# Altium schematic sheet 04_Motors.SchDoc: OpenCamera Slider - Motors
size A4; SheetNumber: 4; SheetTotal: 4; Distributor: DigiKey
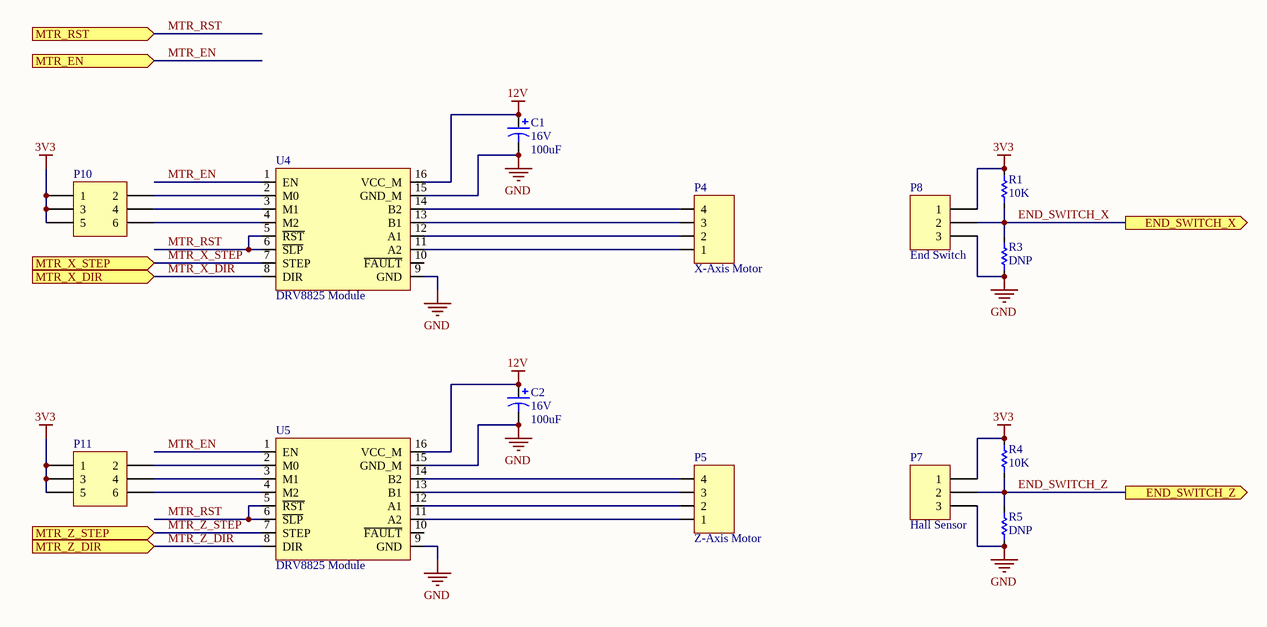
[diagram p0: 04_Motors.SchDoc]

## Parts
C1  16V  value 100uF  [Electrolytic Cap 3.2mm]
C2  16V  value 100uF  [Electrolytic Cap 3.2mm]
P4  X-Axis Motor  [TERMINAL_4POS_90DEG_2PART]
P5  Z-Axis Motor  [TERMINAL_4POS_90DEG_2PART]
P7  Hall Sensor  [TERMINAL_3POS_90DEG_2PART]
P8  End Switch  [TERMINAL_3POS_90DEG_2PART]
P10  Header 3X2  [HDR2X3]  (value not drawn)
P11  Header 3X2  [HDR2X3]  (value not drawn)
R1  value 10K  [0603]  (hidden comment: Res)
R3  value DNP  [0603]  (hidden comment: Res)  (no BOM)
R4  value 10K  [0603]  (hidden comment: Res)
R5  value DNP  [0603]  (hidden comment: Res)  (no BOM)
U4  DRV8825 Module  [DRV8825_Module]
U5  DRV8825 Module  [DRV8825_Module]

## Ports
END_SWITCH_X (out), END_SWITCH_Z (out), MTR_EN (in), MTR_RST (in), MTR_X_DIR (in), MTR_X_STEP (in), MTR_Z_DIR (in), MTR_Z_STEP (in)

## Nets
3V3: P7.1 P8.1 P10.1 P10.3 P10.5 P11.1 P11.3 P11.5 R1.2 R4.2
12V: C1.1 C2.1 U4.16(VCC_M) U5.16(VCC_M)
GND: C1.2 C2.2 P7.3 P8.3 R3.1 R5.1 U4.9(GND) U4.15(GND_M) U5.9(GND) U5.15(GND_M)
END_SWITCH_X: P8.2 R1.1 R3.2 ; port END_SWITCH_X
END_SWITCH_Z: P7.2 R4.1 R5.2 ; port END_SWITCH_Z
MTR_EN: U4.1(EN) U5.1(EN) ; port MTR_EN
MTR_RST: U4.5(~{RST}) U4.6(~{SLP}) U5.5(~{RST}) U5.6(~{SLP}) ; port MTR_RST
MTR_X_DIR: U4.8(DIR) ; port MTR_X_DIR
MTR_X_STEP: U4.7(STEP) ; port MTR_X_STEP
MTR_Z_DIR: U5.8(DIR) ; port MTR_Z_DIR
MTR_Z_STEP: U5.7(STEP) ; port MTR_Z_STEP
NetP4_1: P4.1 U4.11(A2)
NetP4_2: P4.2 U4.12(A1)
NetP4_3: P4.3 U4.13(B1)
NetP4_4: P4.4 U4.14(B2)
NetP5_1: P5.1 U5.11(A2)
NetP5_2: P5.2 U5.12(A1)
NetP5_3: P5.3 U5.13(B1)
NetP5_4: P5.4 U5.14(B2)
NetP10_2: P10.2 U4.2(M0)
NetP10_4: P10.4 U4.3(M1)
NetP10_6: P10.6 U4.4(M2)
NetP11_2: P11.2 U5.2(M0)
NetP11_4: P11.4 U5.3(M1)
NetP11_6: P11.6 U5.4(M2)

Not connected (* = marked no-connect by the designer): U4 10(~{FAULT}); U5 10(~{FAULT})

## Notes on the sheet
- sasakaranovic.com/youtube
- sasakaranovic.com
- sasakaranovic.com/github
- sasakaranovic.com/facebook
- sasakaranovic.com/twitter
- sasakaranovic.com/linkedin

## Library data of the parts
C1 C2 = Cap Electrolytic: Polarized Capacitor (Axial); Manufacturer: Würth Elektronik; Manufacturer Part Number: 870135675003; Distributor: DigiKey; Distributor Part Number: 732-11917-1-ND
P4 P5 = Terminal 4_691322110004: TERM BLOCK HDR 4POS 90DEG 3.5MM; Manufacturer: Würth Elektronik; Distributor: DigiKey; Distributor Part Number: 732-2771-ND; Manufacturer Part Number: 691322110004
P7 P8 = Terminal 3_691322110003_1: TERM BLOCK HDR 3POS 90DEG 3.5MM; Manufacturer: Würth Elektronik; Manufacturer Part Number: 691322110003; Distributor: DigiKey; Distributor Part Number: 732-2770-ND
P10 P11 = Header 3X2: Header, 3-Pin, Dual row; Manufacturer: Molex; Manufacturer Part Number: 0010897080; Distributor: DigiKey; Distributor Part Number: WM13106-ND
R1 R3-R5 = Res: Resistor; Manufacturer: YAGEO; Manufacturer Part Number: AA0603FR-0710KL; Distributor: DigiKey; Distributor Part Number: 13-AA0603FR-0710KLCT-ND
U4 U5 = DRV8825 Module: Distributor: AliExpress; Distributor Part Number: https://www.aliexpress.com/item/32597532420.html; URL: https://www.aliexpress.com/item/32597532420.html